# EAGLE schematic testPresssureSensor (EAGLE 8.2.1)
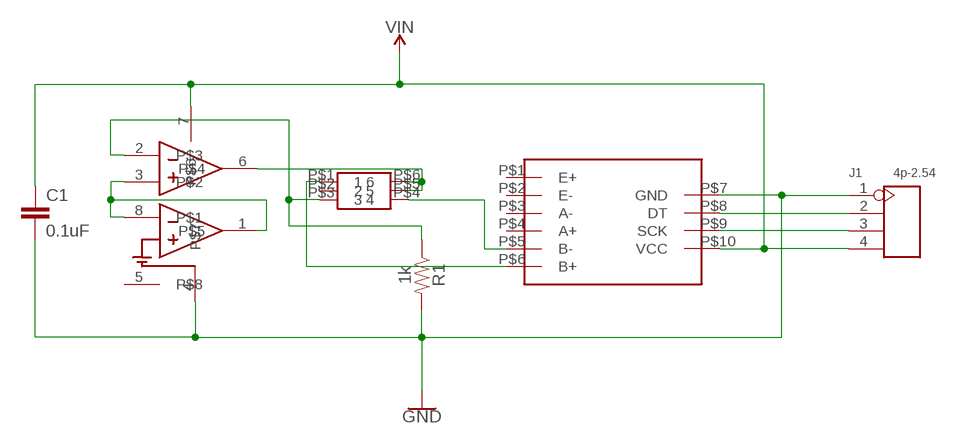
[diagram p0: schematic, sheet 1]

## Parts
C1  0.1uF  0.1UF-0603-25V-(+80/-20%)  [0603]
J1  4p-2.54  DIP-BLACK-MALE-HEADER-VERT(4P-2.54)  [H4-2.54]
R1  1k  1KOHM-HORIZ-1/4W-1%  [AXIAL-0.3]
U$1  2SMPP-03  [2SMPP-03]
U$2  HX711  [HX711]
U$3  LM10CN  [DIP8]

## Nets
GND: C1.2 J1.1 R1.P$2 U$2.P$7(GND) U$3.4
N$1: U$1.P$4 U$2.P$5(B-)
N$2: U$3.1 U$3.3 U$3.8
N$3: U$1.P$5 U$1.P$6 U$3.6
N$4: R1.P$1 U$1.P$3 U$3.2
N$5: U$1.P$1 U$2.P$6(B+)
N$6: J1.2 U$2.P$8(DT)
N$7: J1.3 U$2.P$9(SCK)
VIN: C1.1 J1.4 U$2.P$10(VCC) U$3.7
Unconnected: U$1.P$2 U$2.P$1(E+) U$2.P$2(E-) U$2.P$3(A-) U$2.P$4(A+) U$3.5

## Library data of the parts
C1 = SparkFun-Capacitors:0.1UF: 0.1µF ceramic capacitors A capacitor is a passive two-terminal electrical component used to store electrical energy temporarily in an electric field.; PROD_ID: CAP-00810
J1 = Seeed-Connector -2016:DIP-BLACK-MALE-HEADER-VERT(4P-2.54): 320020017; MPN: P125-1104A0BS116A1
R1 = SparkFun-Resistors:1KOHM: 1kΩ resistor A resistor is a passive two-terminal electrical component that implements electrical resistance as a circuit element. Resistors act to reduce current flow, and, at the same time, act to lower voltage levels within circuits. - Wikipedia; PROD_ID: RES-12182
U$1 = programmable-air-components:2SMPP-03
U$2 = programmable-air-components:HX711
U$3 = programmable-air-components:LM10CN